# EAGLE design nfc_with_data_transfer_no_accel_2.0 (EAGLE 8.0.0)
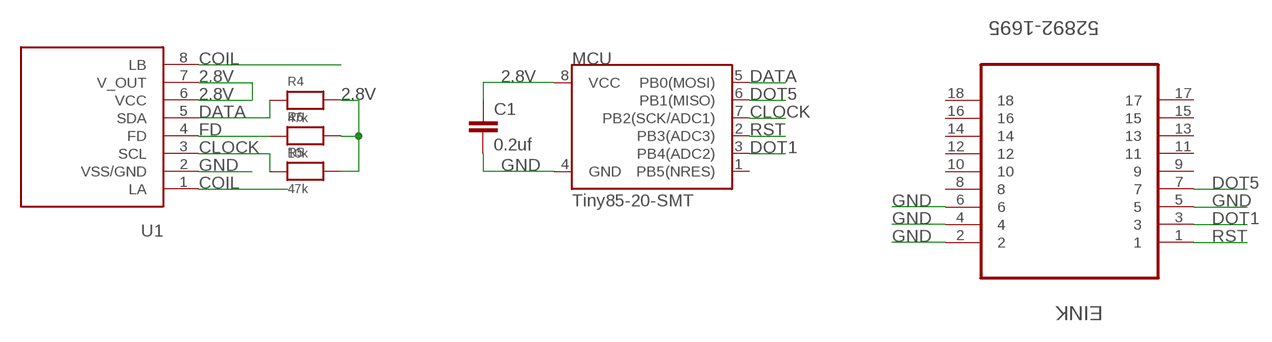
[diagram p0: schematic, sheet 1]

## Parts
C1  0.2uf  CAP1206  [1206]
EINK  52892-1695  [MOLEX_52892-1695]
MCU  Tiny85-20-SMT  ATTINY45TINY85-20-SMT  [SO08-EIAJ]
R4  47k  RESISTOR0603  [0603]
R5  47k  RESISTOR0603  [0603]
R6  10k  RESISTOR0603  [0603]
U1  NT3H1101  [NT3H1101]

## Nets
2.8V: C1.1 MCU.8(VCC) R4.2 R5.2 R6.2 U1.6(VCC) U1.7(V_OUT)
CLOCK: MCU.7(PB2(SCK/ADC1)) R5.1 U1.3(SCL)
COIL: U1.1(LA) U1.8(LB)
DATA: MCU.5(PB0(MOSI)) R4.1 U1.5(SDA)
DOT1: EINK.3 MCU.3(PB4(ADC2))
DOT5: EINK.7 MCU.6(PB1(MISO))
FD: R6.1 U1.4(FD)
GND: C1.2 EINK.2 EINK.4 EINK.5 EINK.6 MCU.4(GND) U1.2(VSS/GND)
RST: EINK.1 MCU.2(PB3(ADC3))
Unconnected: EINK.8 EINK.9 EINK.10 EINK.11 EINK.12 EINK.13 EINK.14 EINK.15 EINK.16 EINK.17 EINK.18 MCU.1(PB5(NRES))

## Library data of the parts
C1 = SparkFun-Capacitors:CAP: Capacitor Standard 0603 ceramic capacitor, and 0.1" leaded capacitor.
EINK = Molex_By_element14_Batch_1:52892-1695: CONNECTOR, FPC, ZIF, 0.50MM, 16 WAY; MPN: 52892-1695; OC_FARNELL: 1556807; OC_NEWARK: 92M6601; PACKAGE: CONNECTOR, FPC, ZIF, 0.50MM, 16 WAY; SUPPLIER: Molex
MCU = SparkFun-DigitalIC:ATTINY45: Atmel 8-pin 2/4/8kB flash uC; PROD_ID: IC-09092
R4-R6 = microbuilder:RESISTOR: Resistors 0402 - 0402 Surface Mount Package 22 Ohm 1% 1/16W [Digikey: 311-22.0LRTR-ND] 33 Ohm 5% 1/16W 1.0K 5% 1/16W 1.5K 5% 1/16W 2.0K 1% 1/16W 10.0K 1% 1/16W [Digikey: 311-10.0KLRTR-ND] 10.0K 5% 1/16W [Digikey: RMCF0402JT10K0TR-ND] 12.1K 1% 1/16W [Digikey: 311-22.0LRTR-ND] 100.0K 5% 1/16W 0603 - 0603 Surface Mount Package 0 Ohm 1/10 Watt 1% Resistor 15 Ohm 1/10 Watt 1% Resistor 33 Ohm 1/10 Watt 1% Resistor 49.9 Ohm 1/10 Watt 1% Resistor 100 Ohm 1/10 Watt 1% Resistor 150 Ohm 1/10 Watt 1% Resistor 240 Ohm 1/10 Watt 1% Resistor 390 Ohm 1/10 Watt 1% Resistor 560 Ohm 1/10 Watt 1% Resistor 680 Ohm 1/10 Watt 1% Resistor 750 Ohm 1/10 Watt 1% Resistor 1.0K Ohm 1/10 Watt 1% Resistor 1.5K Ohm 1/10 Watt 1% Resistor 2.0K Ohm 1/10 Watt 1% Resistor 2.2K Ohm 1/10 Watt 1% Resistor 3.3K Ohm 1/10 Watt 1% Resistor 4.7K Ohm 1/10 Watt 1% Resistor 10.0K Ohm 1/10 Watt 1% Resistor 12.0K Ohm 1/10 Watt 1% Resistor 12.1K Ohm 1/10 Watt 1% Resistor 20.0K Ohm 1/10 Watt 1% Resistor 33.0K Ohm 1/10 Watt 1% Resistor 100.0K Ohm 1/10 Watt 1% Resistor 0805 - 0805 Surface Mount Package 0 Ohm 1/8 Watt 1% Resistor 33 Ohm 1/8 Watt 1% Resistor 100 Ohm 1/8 Watt 1% Resistor 150 Ohm 1/8 Watt 1% Resistor 200 Ohm 1/8 Watt 1% Resistor 240 Ohm 1/8 Watt 1% Resistor 330 Ohm 1/8 Watt 1% Resistor 390 Ohm 1/8 Watt 1% Resistor 470 Ohm 1/8 Watt 1% Resistor 1.0K Ohm 1/8 Watt 1% Resistor 1.5K Ohm 1/8 Watt 1% Resistor 2.0K Ohm 1/8 Watt 1% Resistor 4.7K Ohm 1/8 Watt 1% Resistor 5.1K Ohm 1/8 Watt 1% Resistor 5.6K Ohm 1/8 Watt 1% Resistor 10.0K Ohm 1/8 Watt 1% Resistor 22.0K Ohm 1/8 Watt 1% Resistor 33.0K Ohm 1/8 Watt 1% Resistor 100K Ohm 1/8 Watt 1% Resistor 1206 - 1206 Surface Mount Package 2012 - 2010 Surface Mount Package 0.11 Ohm 1/2 Watt 1% Resistor - Digikey: RHM.11UCT-ND
U1 = AlterNail:NT3H1101

## Board
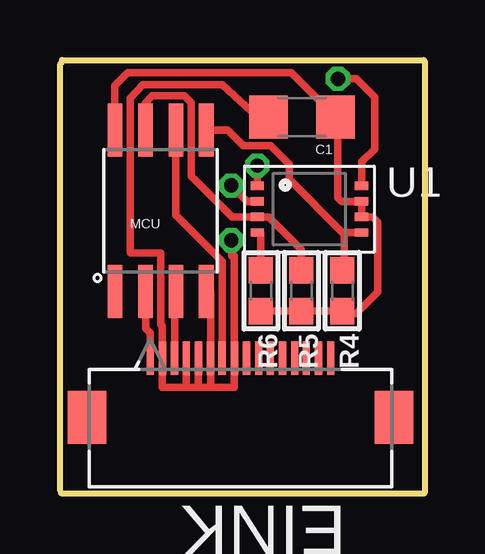
[diagram p1: board, top side]
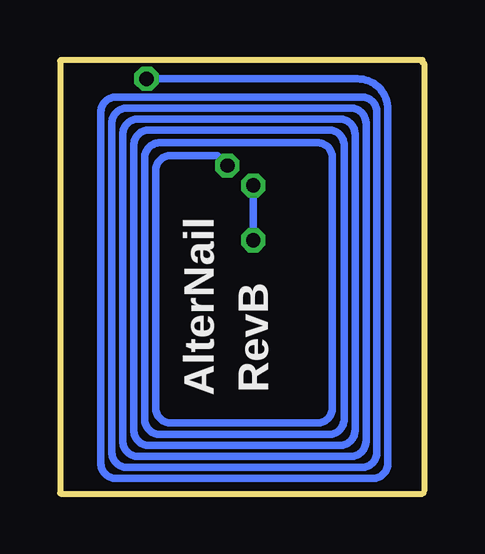
[diagram p2: board, bottom side, seen from below]

Size 15.19 x 18.08 mm. Coordinates in mm from the lower left corner, seen from the top.
Outline: 0,0.15 0,17.91 0.08,17.98
Outline: 0.08,18.08 15.14,18.08 15.19,18.03 15.19,0.03 15.16,0 0.08,0 0.05,0.03
Copper layers (1*16): Top 0.035mm / dielectric 1.5mm / Bottom 0.035mm
Design rules "default": minimum track width 10mil, minimum drill 24mil, track to track 8mil, track to pad 8mil, pad to pad 8mil, via to via 8mil, smd to smd 8mil, copper to edge 40mil, drill to drill 8mil, minimum pad ring 10mil, minimum via ring 8mil, stop-mask expansion 4mil, vias tented up to drill 0mil, thermal gap 10mil

### Footprints (pad centres in the part's own frame; a part is rotated, then mirrored left to right if it is on the bottom)
1206 = smd 1.6 x 1.8: 1 -1.4,0; 2 1.4,0
MOLEX_52892-1695 = smd 0.305 x 1.397: 1 3.759,2.896; 2 3.251,2.896; 3 2.743,2.896; 4 2.261,2.896; 5 1.753,2.896; 6 1.245,2.896; 7 0.762,2.896; 8 0.254,2.896; 9 -0.254,2.896; 10 -0.762,2.896; 11 -1.245,2.896; 12 -1.753,2.896; 13 -2.261,2.896; 14 -2.743,2.896; 15 -3.251,2.896; 16 -3.759,2.896 | smd 1.6 x 2.21: 17 -6.401,5.359; 18 6.401,5.359
SO08-EIAJ = smd 0.61 x 2.21: 1 -1.905,-3.378; 2 -0.635,-3.378; 3 0.635,-3.378; 4 1.905,-3.378; 5 1.905,3.353; 6 0.635,3.353; 7 -0.635,3.353; 8 -1.905,3.353
0603 = smd 1.1 x 1: 1 -0.85,0; 2 0.85,0
NT3H1101 = smd 0.55 x 0.35: 1 -2.175,0.975; 2 -2.175,0.325; 3 -2.175,-0.325; 4 -2.175,-0.975; 5 2.175,-0.975; 6 2.175,-0.325; 7 2.175,0.325; 8 2.175,0.975; P$5 -2.175,-0.325

### Placement (x,y rotation side)
C1  10.08,15.7 180 top
EINK  7.52,8.53 180 top
MCU  4.19,11.81 0 top
R4  11.76,8.46 270 top
R5  10.06,8.46 270 top
R6  8.37,8.46 270 top
U1  10.39,11.86 0 top

### Tracks (layer width: path | path; a pad name or v marks a point on that pad's centre or on a via)
2.8V
  Top 0.305: R6.2 R5.2 R4.2 11.85,7.52 12.34,7.52 13.23,8.41 13.23,11.33 13.03,11.54 U1.6 U1.7 11.74,12.19 11.58,12.34 11.58,15.6 C1.1 9.63,17.55 2.82,17.55 2.29,17.02 MCU.8
CLOCK
  Top 0.305: 9.93,9.17 R5.1 10.06,10.19 8.71,11.54 U1.3 7.18,11.54 5.46,13.23 5.46,16.31 5.18,16.59 3.84,16.59 3.56,16.28 MCU.7
COIL  (via drill 0.6)
  Top 0.305: U1.1 8.21,13.3 v8.22,13.68 | U1.8 12.58,12.84 12.58,13.85 13.11,14.38 13.11,16.54 12.34,17.3 v11.58,17.3
  Bottom 0.305: v8.22,13.68 8.64,14.1 10.57,14.1 arc-90 11.2,13.46 11.2,3.58 arc-90 10.57,2.95 4.47,2.95 arc-90 3.84,3.58 3.84,14 arc-90 4.47,14.63 11.02,14.63 arc-90 11.66,14 11.66,3.1 arc-90 11.02,2.46 3.99,2.46 arc-90 3.35,3.1 3.35,14.53 arc-90 3.99,15.16 11.48,15.16 arc-90 12.12,14.53 12.12,2.64 arc-90 11.48,2.01 3.53,2.01 arc-90 2.9,2.64 2.9,14.99 arc-90 3.53,15.62 11.94,15.62 arc-90 12.57,14.99 12.57,2.18 arc-90 11.94,1.55 3.07,1.55 arc-90 2.44,2.18 2.44,15.44 arc-90 3.07,16.08 12.4,16.08 arc-90 13.03,15.44 13.03,1.73 arc-90 12.4,1.09 2.62,1.09 arc-90 1.98,1.73 1.98,15.9 arc-90 2.62,16.54 12.85,16.54 arc-90 13.49,15.9 13.49,1.27 arc-90 12.85,0.64 2.16,0.64 arc-90 1.52,1.27 1.52,16.03 arc-90 2.79,17.3 v11.58,17.3
DATA
  Top 0.305: 11.63,8.94 R4.1 11.84,9.38 11.84,10.82 11.9,10.89 | MCU.5 6.99,15.16 7.65,14.5 8.79,14.5 9.55,13.74 9.55,13.11 11.77,10.89 11.9,10.89 | U1.5 11.9,10.89
DOT1
  Top 0.305: EINK.3 4.78,8.38 MCU.3
DOT5
  Top 0.305: MCU.6 4.83,11.61 6.76,9.68 EINK.7
FD
  Top 0.305: U1.4 8.37,10.89 R6.1
GND  (via drill 0.6)
  Top 0.305: C1.2 8.23,15.7 6.76,17.04 3.45,17.04 2.92,16.48 2.92,10.06 2.95,10.03 4.19,10.03 4.19,7.06 4.27,6.99 EINK.2 4.27,4.42 5.26,4.42 | U1.2 7.8,12.19 v7.14,12.85 | 6.27,4.42 EINK.6 6.27,8.43 MCU.4 | v7.14,10.57 7.16,10.57 7.16,9.91 7.26,9.91 7.26,4.42 6.27,4.42 | 5.26,4.42 5.77,4.42 | 5.77,4.42 6.27,4.42 | EINK.5 5.77,4.42 | EINK.4 5.26,4.42
  Bottom 0.305: v7.14,12.85 v7.14,10.57
RST
  Top 0.305: 3.76,5.94 EINK.1 3.76,6.71 3.58,6.88 3.58,8.41 MCU.2

### Text on the board
bNames: RevB | AlterNail